# Altium project PCB_Project.PrjPcb
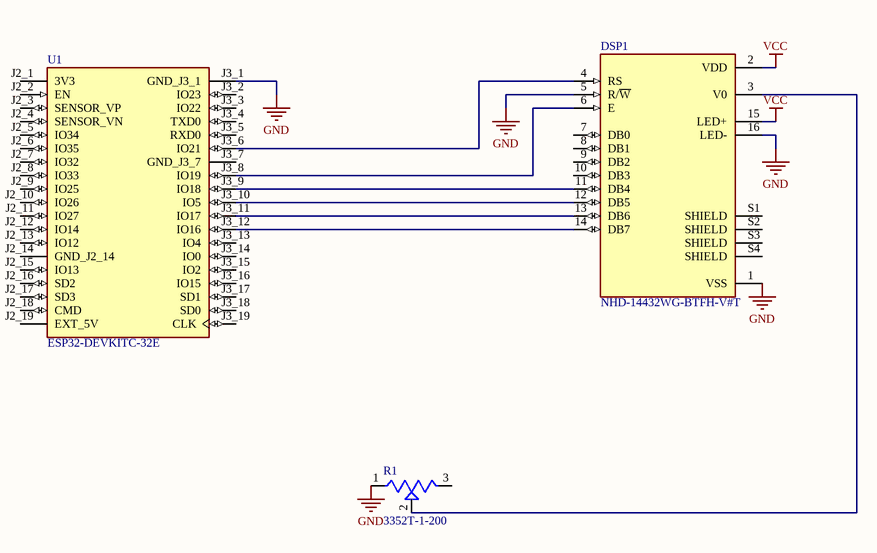
[diagram p0: Sheet1.SchDoc]
1 sheet, 3 parts. Net scope: global (net labels, ports and power ports of the same name join across sheets).
Board file: PCB1.PcbDoc

## Sheet Sheet1.SchDoc
size A4; SheetNumber: 1; SheetTotal: 1

### Parts
DSP1  NHD-14432WG-BTFH-V#T  [LCD_NHD-14432WG-BTFH-V#T]
R1  3352T-1-200  [TRIM_3352T-1-200]
U1  ESP32-DEVKITC-32E  [MODULE_ESP32-DEVKITC-32E]

### Nets
GND: DSP1.1(VSS) DSP1.5(R/~{W}) DSP1.16(LED-) R1.1(CCW) U1.J3_1(GND_J3_1)
VCC: DSP1.2(VDD) DSP1.15(LED+)
NetDSP1_3: DSP1.3(V0) R1.2(WIPER)
NetDSP1_4: DSP1.4(RS) U1.J3_6(IO21)
NetDSP1_6: DSP1.6(E) U1.J3_8(IO19)
NetDSP1_11: DSP1.11(DB4) U1.J3_9(IO18)
NetDSP1_12: DSP1.12(DB5) U1.J3_10(IO5)
NetDSP1_13: DSP1.13(DB6) U1.J3_11(IO17)
NetDSP1_14: DSP1.14(DB7) U1.J3_12(IO16)

Not connected (* = marked no-connect by the designer): DSP1 7(DB0) 8(DB1) 9(DB2) 10(DB3) S1(SHIELD) S2(SHIELD) S3(SHIELD) S4(SHIELD); R1 3(CW); U1 J2_1(3V3) J2_2(EN) J2_3(SENSOR_VP) J2_4(SENSOR_VN) J2_5(IO34) J2_6(IO35) J2_7(IO32) J2_8(IO33) J2_9(IO25) J2_10(IO26) J2_11(IO27) J2_12(IO14) J2_13(IO12) J2_14(GND_J2_14) J2_15(IO13) J2_16(SD2) J2_17(SD3) J2_18(CMD) J2_19(EXT_5V) J3_2(IO23) J3_3(IO22) J3_4(TXD0) J3_5(RXD0) J3_7(GND_J3_7) J3_13(IO4) J3_14(IO0) J3_15(IO2) J3_16(IO15) J3_17(SD1) J3_18(SD0) J3_19(CLK)

### Library data of the parts
DSP1 = NHD-14432WG-BTFH-V#T: - Graphic LCD Display Module Transflective Black (White - Inverted) FSTN - Film Super-Twisted Nematic Parallel, 8-Bit - 144 x 32; MF: Newhaven Display; SnapEDA_Link: https://www.snapeda.com/parts/NHD-14432WG-BTFH-V%23T/Newhaven+Display+Intl/view-part/?ref=snap; Package: None; MP: NHD-14432WG-BTFH-V#T; Check_prices: https://www.snapeda.com/parts/NHD-14432WG-BTFH-V%23T/Newhaven+Display+Intl/view-part/?ref=eda; Purchase-URL: https://pricing.snapeda.com/search/part/NHD-14432WG-BTFH-V#T/?ref=eda; Price: None; Value: *; Availability: In Stock
R1 = 3352T-1-200: 20 Ohms 0.5W, 1/2W Through Hole Thumbwheel Potentiometer Top Adjustment; MF: Bourns; Price: None; Purchase-URL: https://pricing.snapeda.com/search/part/3352T-1-200/?ref=eda; Package: 3352T-3 Bourns; Check_prices: https://www.snapeda.com/parts/3352T-1-200/Bourns/view-part/?ref=eda; Availability: In Stock; MP: 3352T-1-200; Value: *; SnapEDA_Link: https://www.snapeda.com/parts/3352T-1-200/Bourns/view-part/?ref=snap
U1 = ESP32-DEVKITC-32E: The ESP32-DEVKITC-32E transceiver evaluation board from Espressif Systems is a powerful development tool for wireless communication technologies. It supports 802.11 b/g/n Wi-Fi and BluetoothÂ® Smart Ready 4.x (BLE) dual-mode at 2.4GHz, making it ideal for; SnapEDA_Link: https://www.snapeda.com/parts/ESP32-DEVKITC-32E/Espressif+Systems/view-part/?ref=snap; Package: None; Value: *; MF: Espressif Systems; MP: ESP32-DEVKITC-32E; Check_prices: https://www.snapeda.com/parts/ESP32-DEVKITC-32E/Espressif+Systems/view-part/?ref=eda